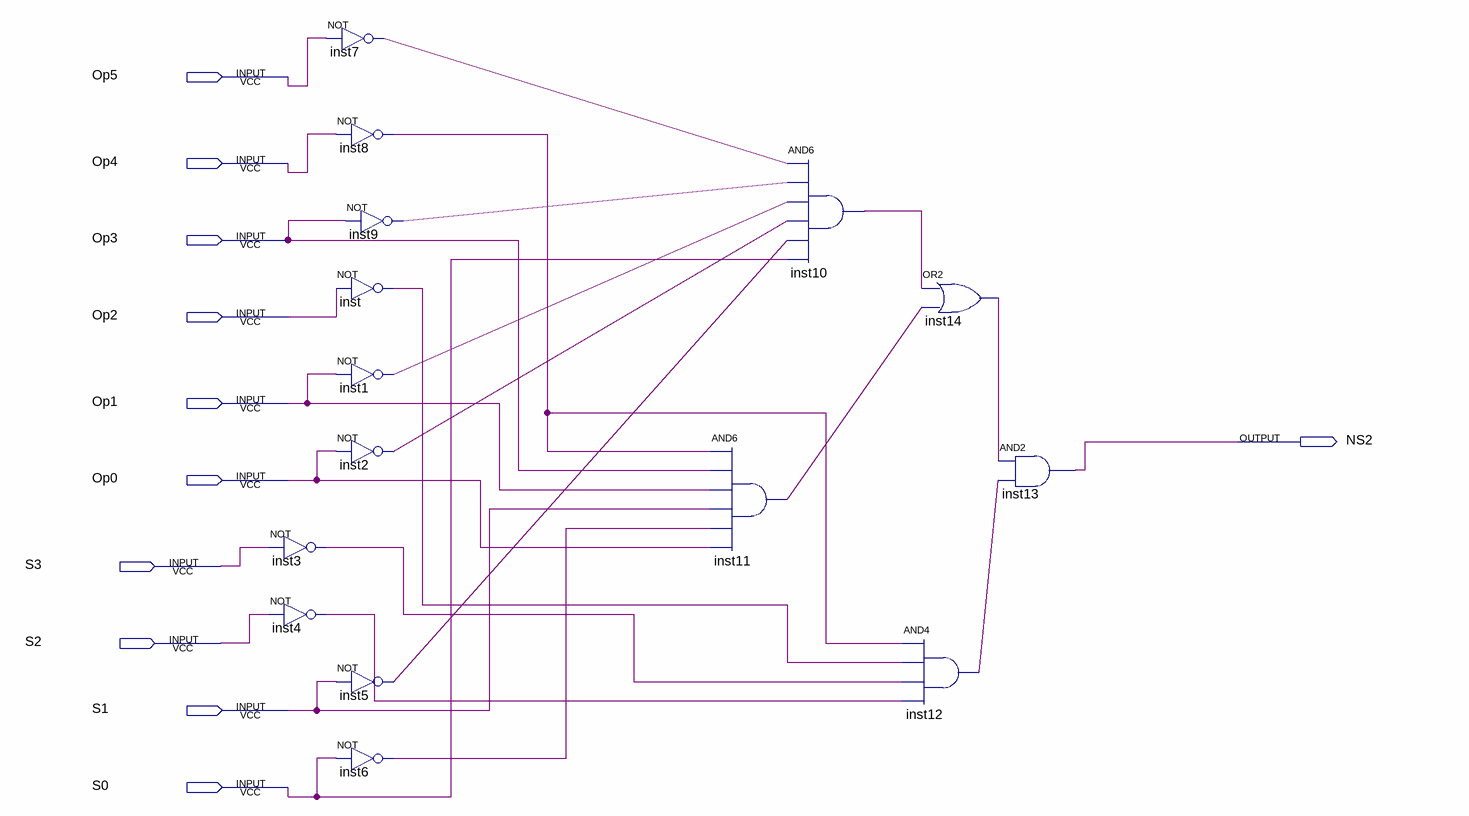
[diagram p0: schematic sheet]
// Quartus schematic NS2.bdf as structural Verilog: 15 symbols, 11 pins
module NS2 (
  input  Op5,
  input  Op4,
  input  Op3,
  input  Op2,
  input  Op1,
  input  Op0,
  input  S3,
  input  S2,
  input  S1,
  input  S0,
  output NS2
);

  wire inst1_out, inst2_out, inst3_out, inst4_out, inst5_out, inst6_out, inst7_out, inst8_out, inst9_out,
       inst10_out, inst11_out, inst12_out, inst14_out, inst_out;

  not inst3 (inst3_out, S3);
  not inst4 (inst4_out, S2);
  not inst7 (inst7_out, Op5);
  not inst8 (inst8_out, Op4);
  not inst9 (inst9_out, Op3);
  not inst (inst_out, Op2);
  not inst1 (inst1_out, Op1);
  not inst2 (inst2_out, Op0);
  not inst5 (inst5_out, S1);
  not inst6 (inst6_out, S0);
  and inst11 (inst11_out, inst8_out, Op3, Op1, S1, inst6_out, Op0);
  and inst10 (inst10_out, inst7_out, inst9_out, inst1_out, inst2_out, inst5_out, S0);
  and inst12 (inst12_out, inst8_out, inst_out, inst3_out, inst4_out);
  or inst14 (inst14_out, inst10_out, inst11_out);
  and inst13 (NS2, inst14_out, inst12_out);
endmodule
